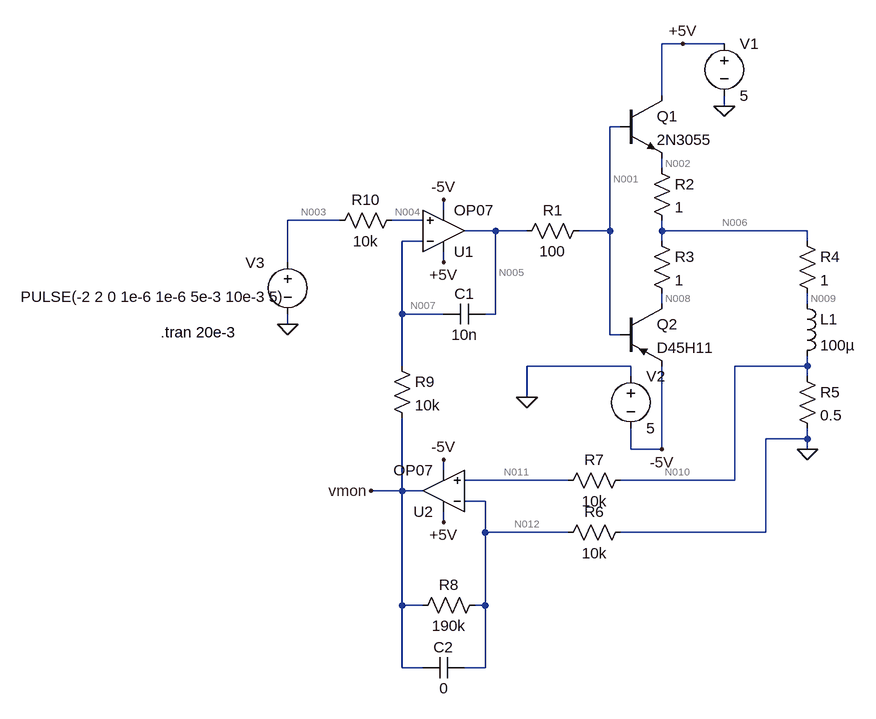
[diagram p0: schematic mockup.asc]
mockup.asc, the LTspice schematic file:
Version 4
SHEET 1 880 832
WIRE 256 -176 224 -176
WIRE 320 -176 256 -176
WIRE 224 -96 224 -176
WIRE 320 -80 320 -96
WIRE 160 -48 144 -48
WIRE 224 16 224 0
WIRE -112 80 -112 64
WIRE -272 96 -352 96
WIRE -144 96 -192 96
WIRE -32 112 -80 112
WIRE 16 112 -32 112
WIRE 144 112 144 -48
WIRE 144 112 96 112
WIRE 224 112 224 96
WIRE 448 112 224 112
WIRE -144 128 -176 128
WIRE 224 128 224 112
WIRE 448 128 448 112
WIRE -352 160 -352 96
WIRE -112 160 -112 144
WIRE 224 224 224 208
WIRE 448 224 448 208
WIRE -176 240 -176 128
WIRE -112 240 -176 240
WIRE -32 240 -32 112
WIRE -32 240 -48 240
WIRE -352 256 -352 240
WIRE 144 272 144 112
WIRE 160 272 144 272
WIRE -176 320 -176 240
WIRE 176 320 16 320
WIRE 448 320 448 304
WIRE 448 320 336 320
WIRE 176 336 176 320
WIRE 448 336 448 320
WIRE 16 368 16 320
WIRE 448 432 448 416
WIRE 448 432 384 432
WIRE 176 448 176 416
WIRE 224 448 224 320
WIRE 224 448 176 448
WIRE 448 448 448 432
WIRE -112 480 -112 464
WIRE 80 496 -80 496
WIRE 336 496 336 320
WIRE 336 496 160 496
WIRE -176 512 -176 400
WIRE -176 512 -224 512
WIRE -144 512 -176 512
WIRE -48 528 -80 528
WIRE -112 560 -112 544
WIRE -48 576 -48 528
WIRE 80 576 -48 576
WIRE 384 576 384 432
WIRE 384 576 160 576
WIRE -176 688 -176 512
WIRE -144 688 -176 688
WIRE -48 688 -48 576
WIRE -48 688 -64 688
WIRE -176 784 -176 688
WIRE -144 784 -176 784
WIRE -48 784 -48 688
WIRE -48 784 -80 784
FLAG 448 448 0
FLAG 16 368 0
FLAG 320 -80 0
FLAG 224 448 -5V
FLAG 256 -176 +5V
FLAG -112 560 +5V
FLAG -112 464 -5V
FLAG -112 64 -5V
FLAG -112 160 +5V
FLAG -352 256 0
FLAG -224 512 vmon
SYMBOL ind 432 208 R0
SYMATTR InstName L1
SYMATTR Value 100µ
SYMBOL res 112 96 R90
WINDOW 0 0 56 VBottom 2
WINDOW 3 32 56 VTop 2
SYMATTR InstName R1
SYMATTR Value 100
SYMBOL npn 160 -96 R0
SYMATTR InstName Q1
SYMATTR Value 2N3055
SYMBOL pnp 160 224 R0
SYMATTR InstName Q2
SYMATTR Value D45H11
SYMBOL res 208 0 R0
SYMATTR InstName R2
SYMATTR Value 1
SYMBOL res 208 112 R0
SYMATTR InstName R3
SYMATTR Value 1
SYMBOL voltage 320 -192 R0
WINDOW 123 0 0 Left 2
WINDOW 39 0 0 Left 2
SYMATTR InstName V1
SYMATTR Value 5
SYMBOL voltage 176 320 R0
WINDOW 123 0 0 Left 2
WINDOW 39 0 0 Left 2
SYMATTR InstName V2
SYMATTR Value 5
SYMBOL res 432 112 R0
SYMATTR InstName R4
SYMATTR Value 1
SYMBOL res 432 320 R0
SYMATTR InstName R5
SYMATTR Value 0.5
SYMBOL Opamps\\OP07 -112 176 M180
SYMATTR InstName U1
SYMBOL res 176 560 R90
WINDOW 0 0 56 VBottom 2
WINDOW 3 32 56 VTop 2
SYMATTR InstName R6
SYMATTR Value 10k
SYMBOL Opamps\\OP07 -112 576 R180
SYMATTR InstName U2
SYMBOL res 176 480 R90
WINDOW 0 0 56 VBottom 2
WINDOW 3 32 56 VTop 2
SYMATTR InstName R7
SYMATTR Value 10k
SYMBOL res -48 672 R90
WINDOW 0 0 56 VBottom 2
WINDOW 3 32 56 VTop 2
SYMATTR InstName R8
SYMATTR Value 190k
SYMBOL res -192 304 R0
SYMATTR InstName R9
SYMATTR Value 10k
SYMBOL cap -48 224 R90
WINDOW 0 0 32 VBottom 2
WINDOW 3 32 32 VTop 2
SYMATTR InstName C1
SYMATTR Value 10n
SYMBOL res -176 80 R90
WINDOW 0 0 56 VBottom 2
WINDOW 3 32 56 VTop 2
SYMATTR InstName R10
SYMATTR Value 10k
SYMBOL voltage -352 144 R0
WINDOW 0 -65 17 Left 2
WINDOW 3 -411 69 Left 2
WINDOW 123 0 0 Left 2
WINDOW 39 0 0 Left 2
SYMATTR InstName V3
SYMATTR Value PULSE(-2 2 0 1e-6 1e-6 5e-3 10e-3 5)
SYMBOL cap -80 768 R90
WINDOW 0 0 32 VBottom 2
WINDOW 3 32 32 VTop 2
SYMATTR InstName C2
SYMATTR Value 0
TEXT -548 268 Left 2 !.tran 20e-3

The netlist it stands for:
* mockup.asc
L1 N009 N010 100µ
R1 N001 N005 100
Q1 +5V N001 N002 0 2N3055
Q2 N008 N001 -5V 0 D45H11
R2 N002 N006 1
R3 N006 N008 1
V1 +5V 0 5
V2 0 -5V 5
R4 N006 N009 1
R5 N010 0 0.5
XU1 N004 N007 +5V -5V N005 LT1001  ; OP07, pins In+ In- V+ V- OUT
R6 0 N012 10k
XU2 N011 N012 +5V -5V vmon LT1001  ; OP07, pins In+ In- V+ V- OUT
R7 N010 N011 10k
R8 N012 vmon 190k
R9 N007 vmon 10k
C1 N005 N007 10n
R10 N004 N003 10k
V3 N003 0 PULSE(-2 2 0 1e-6 1e-6 5e-3 10e-3 5)
C2 N012 vmon 0
.model NPN NPN
.model PNP PNP
.lib standard.bjt
.tran 20e-3
.lib LTC.lib
.backanno
.end

* Results of the author's LTspice run, read from the files saved beside the schematic
* Operating Point, zero values left out:
*   V(n009) = -37.67 mV
*   V(n010) = -37.59 mV
*   V(n001) = -915.7 mV
*   V(n005) = -3.283 V
*   V(+5v) = 5 V
*   V(n002) = -112.9 mV
*   V(n008) = -188 mV
*   V(-5v) = -5 V
*   V(n006) = -112.9 mV
*   V(n007) = -815.5 mV
*   V(n004) = -1.936 V
*   V(n012) = -37.59 mV
*   V(n011) = -37.59 mV
*   V(vmon) = -751.8 mV
*   V(n003) = -2 V
*   Ic(Q2) = 75.18 mA
*   Ib(Q2) = -23.68 mA
*   Ie(Q2) = -51.51 mA
*   Ic(Q1) = 8.916 nA
*   Ib(Q1) = -9.241 nA
*   Ie(Q1) = 325.5 pA
*   I(L1) = -75.18 mA
*   I(R10) = 6.366 µA
*   I(R9) = -6.366 µA
*   I(R8) = 3.759 µA
*   I(R6) = 3.759 µA
*   I(R5) = -75.18 mA
*   I(R4) = -75.18 mA
*   I(R3) = 75.18 mA
*   I(R2) = -325.5 pA
*   I(R1) = 23.68 mA
*   I(V3) = 6.366 µA
*   I(V2) = -77.43 mA
*   I(V1) = -2.251 mA
*   Ix(u1:1) = -6.366 µA
*   Ix(u1:2) = 6.366 µA
*   Ix(u1:3) = 942 pA
*   Ix(u1:4) = -23.67 mA
*   Ix(u1:5) = 23.68 mA
*   Ix(u2:3) = 2.251 mA
*   Ix(u2:4) = -2.249 mA
*   Ix(u2:5) = -2.607 µA
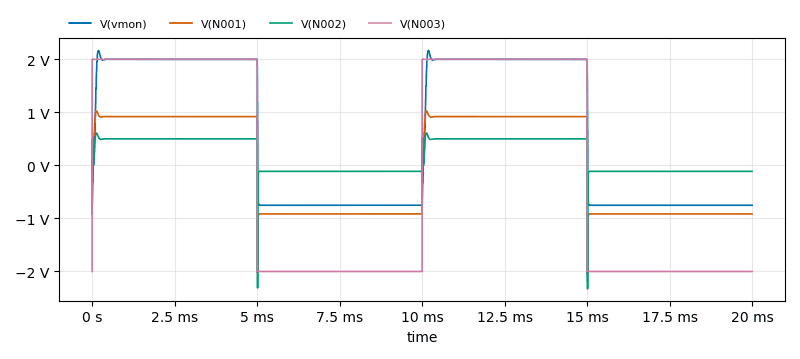
[diagram p1: Transient Analysis of mockup.asc, plotted from the saved traces]
* Transient Analysis, 1 run:
*   V(vmon): min -751.8 mV, max 2.168 V, average 609 mV, rms 1.498 V, last -751.8 mV
*   V(N001): min -2.048 V, max 1.027 V, average -3.447 mV, rms 916.5 mV, last -915.7 mV
*   V(N002): min -2.327 V, max 609.6 mV, average 189.8 mV, rms 366 mV, last -112.9 mV
*   V(N003): min -2 V, max 2 V, average 400 µV, rms 2 V, last -2 V